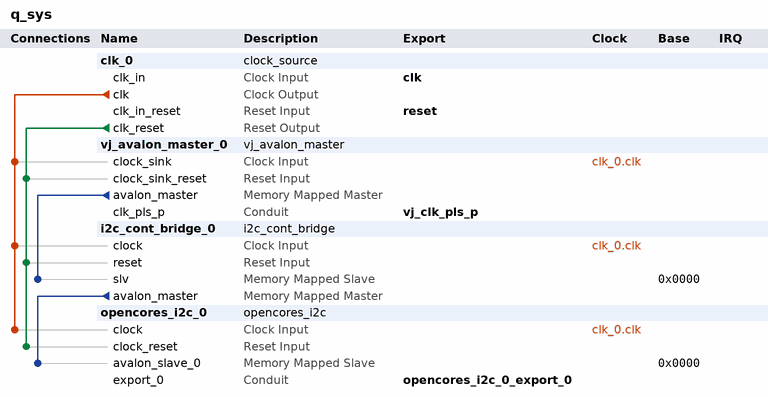
[diagram p0: system contents]
# Platform Designer (Qsys) system q_sys, MAX V 5M2210ZF256I5
# Parameters at their usual value, and those the tool derives, are not listed.
package require -exact qsys 18.1
create_system q_sys
set_project_property DEVICE_FAMILY {MAX V}
set_project_property DEVICE 5M2210ZF256I5

add_instance clk_0 clock_source 18.1
set_instance_parameter_value clk_0 clockFrequency 50000000

add_instance vj_avalon_master_0 vj_avalon_master 1.0

add_instance i2c_cont_bridge_0 i2c_cont_bridge 1.0

add_instance opencores_i2c_0 opencores_i2c 9.1

# connections
add_connection clk_0.clk i2c_cont_bridge_0.clock clock
add_connection clk_0.clk opencores_i2c_0.clock clock
add_connection clk_0.clk vj_avalon_master_0.clock_sink clock
add_connection clk_0.clk_reset i2c_cont_bridge_0.reset reset
add_connection clk_0.clk_reset opencores_i2c_0.clock_reset reset
add_connection clk_0.clk_reset vj_avalon_master_0.clock_sink_reset reset
add_connection i2c_cont_bridge_0.avalon_master opencores_i2c_0.avalon_slave_0 avalon
set_connection_parameter_value i2c_cont_bridge_0.avalon_master/opencores_i2c_0.avalon_slave_0 baseAddress 0x0000
add_connection vj_avalon_master_0.avalon_master i2c_cont_bridge_0.slv avalon
set_connection_parameter_value vj_avalon_master_0.avalon_master/i2c_cont_bridge_0.slv baseAddress 0x0000

# exported interfaces
add_interface clk clock sink
set_interface_property clk EXPORT_OF clk_0.clk_in
add_interface opencores_i2c_0_export_0 conduit end
set_interface_property opencores_i2c_0_export_0 EXPORT_OF opencores_i2c_0.export_0
add_interface reset reset sink
set_interface_property reset EXPORT_OF clk_0.clk_in_reset
add_interface vj_clk_pls_p conduit end
set_interface_property vj_clk_pls_p EXPORT_OF vj_avalon_master_0.clk_pls_p

set_interconnect_requirement {$system} qsys_mm.clockCrossingAdapter AUTO
set_interconnect_requirement {$system} qsys_mm.maxAdditionalLatency 0

save_system q_sys.qsys
